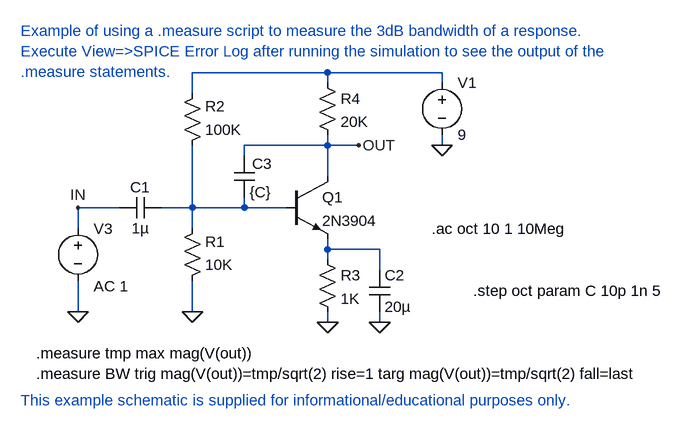
[diagram p0: schematic DotMeas.asc]
DotMeas.asc, the LTspice schematic file:
Version 4
SHEET 1 2344 1936
WIRE 400 1152 192 1152
WIRE 576 1152 400 1152
WIRE 400 1168 400 1152
WIRE 576 1168 576 1152
WIRE 192 1184 192 1152
WIRE 400 1264 400 1248
WIRE 400 1264 272 1264
WIRE 448 1264 400 1264
WIRE 576 1264 576 1248
WIRE 272 1280 272 1264
WIRE 400 1312 400 1264
WIRE 80 1360 16 1360
WIRE 192 1360 192 1264
WIRE 192 1360 144 1360
WIRE 272 1360 272 1344
WIRE 272 1360 192 1360
WIRE 336 1360 272 1360
WIRE 16 1392 16 1360
WIRE 192 1392 192 1360
WIRE 400 1424 400 1408
WIRE 480 1424 400 1424
WIRE 400 1440 400 1424
WIRE 480 1456 480 1424
WIRE 16 1520 16 1472
WIRE 192 1520 192 1472
WIRE 400 1536 400 1520
WIRE 480 1536 480 1520
FLAG 16 1520 0
FLAG 16 1360 IN
FLAG 192 1520 0
FLAG 400 1536 0
FLAG 448 1264 OUT
FLAG 576 1264 0
FLAG 480 1536 0
SYMBOL npn 336 1312 R0
SYMATTR InstName Q1
SYMATTR Value 2N3904
SYMBOL res 384 1424 R0
SYMATTR InstName R3
SYMATTR Value 1K
SYMBOL voltage 16 1376 R0
WINDOW 123 24 105 Left 0
SYMATTR Value2 AC 1
SYMATTR InstName V3
SYMATTR Value ""
SYMBOL res 176 1488 M180
WINDOW 0 36 76 Left 0
WINDOW 3 36 40 Left 0
SYMATTR InstName R1
SYMATTR Value 10K
SYMBOL cap 144 1344 R90
WINDOW 0 0 32 VBottom 0
WINDOW 3 32 32 VTop 0
SYMATTR InstName C1
SYMATTR Value 1µ
SYMBOL res 176 1280 M180
WINDOW 0 36 76 Left 0
WINDOW 3 36 40 Left 0
SYMATTR InstName R2
SYMATTR Value 100K
SYMBOL voltage 576 1152 R0
SYMATTR InstName V1
SYMATTR Value 9
SYMBOL cap 464 1456 R0
SYMATTR InstName C2
SYMATTR Value 20µ
SYMBOL res 384 1152 R0
SYMATTR InstName R4
SYMATTR Value 20K
SYMBOL cap 256 1344 M180
WINDOW 0 28 52 Left 0
WINDOW 3 24 8 Left 0
SYMATTR InstName C3
SYMATTR Value {C}
TEXT 560 1392 Left 0 !.ac oct 10 1 10Meg
TEXT -72 1656 Left 0 ;This example schematic is supplied for informational/educational purposes only.
TEXT -48 1584 Left 0 !.measure tmp max mag(V(out))\n.measure BW trig mag(V(out))=tmp/sqrt(2) rise=1 targ mag(V(out))=tmp/sqrt(2) fall=last
TEXT -72 1088 Left 0 ;Example of using a .measure script to measure the 3dB bandwidth of a response.\nExecute View=>SPICE Error Log after running the simulation to see the output of the\n.measure statements.
TEXT 624 1488 Left 0 !.step oct param C 10p 1n 5

The netlist it stands for:
* DotMeas.asc
Q1 OUT N002 N003 0 2N3904
R3 N003 0 1K
V3 IN 0 AC 1
R1 0 N002 10K
C1 N002 IN 1µ
R2 N002 N001 100K
V1 N001 0 9
C2 N003 0 20µ
R4 N001 OUT 20K
C3 N002 OUT {C}
.model NPN NPN
.model PNP PNP
.lib standard.bjt
.ac oct 10 1 10Meg
* This example schematic is supplied for informational/educational purposes only.
.measure tmp max mag(V(out))
.measure BW trig mag(V(out))=tmp/sqrt(2) rise=1 targ mag(V(out))=tmp/sqrt(2) fall=last
* Example of using a .measure script to measure the 3dB bandwidth of a response.
* Execute View=>SPICE Error Log after running the simulation to see the output of the
* .measure statements.
.step oct param C 10p 1n 5
.backanno
.end